# Altium schematic sheet yard-ice-cpu.SchDoc: Yard-Ice-CPU
size 365 x 274 mm; Revision: 1.0; SheetNumber: 3; SheetTotal: 5
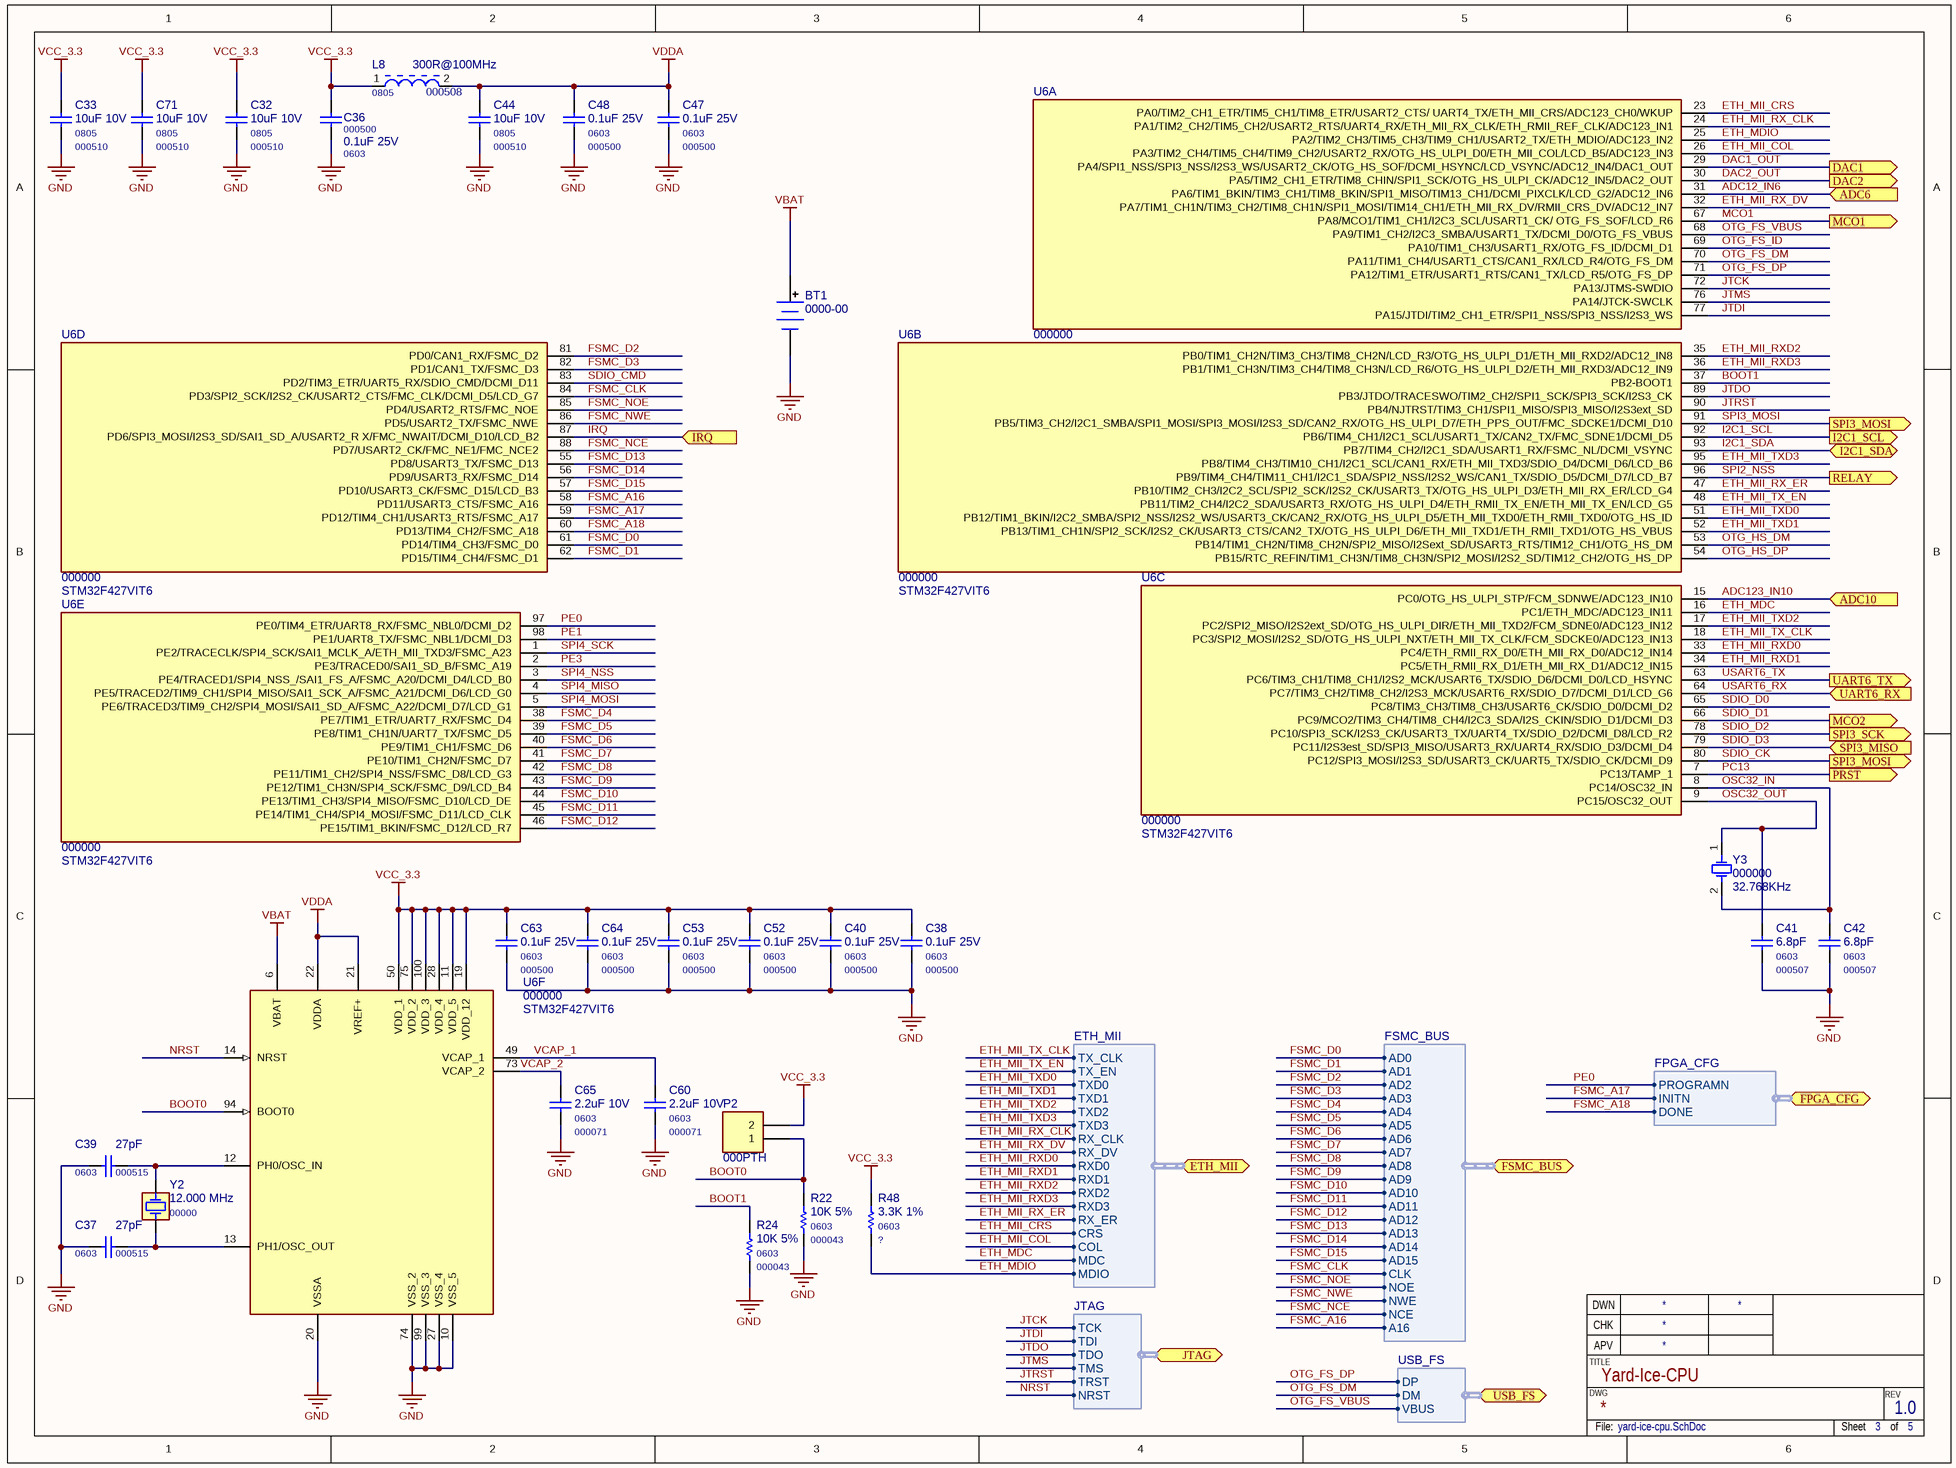
[diagram p0: yard-ice-cpu.SchDoc]

## Parts
BT1  0000-00  [CR-1632/VCN]
C32  000510  value 10uF 10V  Package: 0805  [C0805M]
C33  000510  value 10uF 10V  Package: 0805  [C0805M]
C36  000500  value 0.1uF 25V  Package: 0603  [C0603M]
C37  000515  value 27pF  Package: 0603  [C0603M]
C38  000500  value 0.1uF 25V  Package: 0603  [C0603M]
C39  000515  value 27pF  Package: 0603  [C0603M]
C40  000500  value 0.1uF 25V  Package: 0603  [C0603M]
C41  000507  value 6.8pF  Package: 0603  [C0603M]
C42  000507  value 6.8pF  Package: 0603  [C0603M]
C44  000510  value 10uF 10V  Package: 0805  [C0805M]
C47  000500  value 0.1uF 25V  Package: 0603  [C0603M]
C48  000500  value 0.1uF 25V  Package: 0603  [C0603M]
C52  000500  value 0.1uF 25V  Package: 0603  [C0603M]
C53  000500  value 0.1uF 25V  Package: 0603  [C0603M]
C60  000071  value 2.2uF 10V  Package: 0603  [C0603M]
C63  000500  value 0.1uF 25V  Package: 0603  [C0603M]
C64  000500  value 0.1uF 25V  Package: 0603  [C0603M]
C65  000071  value 2.2uF 10V  Package: 0603  [C0603M]
C71  000510  value 10uF 10V  Package: 0805  [C0805M]
L8  000508  value 300R@100MHz  Package: 0805  [L0805M]
P2  000PTH  [TSW-102-07-G-S]
R22  000043  value 10K 5%  Package: 0603  [R0603M]
R24  000043  value 10K 5%  Package: 0603  [R0603M]
R48  ?  value 3.3K 1%  Package: 0603  [R0603M]
U6  000000  value STM32F427VIT6  [LQFP100]  (parts A,B,C,D,E,F of 6)
Y2  00000  value 12.000 MHz  [ABM3-H]
Y3  000000  value 32.768KHz  [CA-301-V]

## Ports
ADC6 (in), ADC10 (in), DAC1 (out), DAC2 (out), ETH_MII (harness ETH_MII), FPGA_CFG (harness FPGA_CFG), FSMC_BUS (harness FSMC_BUS), I2C1_SCL (out), I2C1_SDA (bidir), IRQ (in), JTAG (harness JTAG), MCO1 (out), MCO2 (out), PRST (out), RELAY (out), SPI3_MISO (in), SPI3_MOSI (out), SPI3_SCK (out), UART6_RX (in), UART6_TX (out), USB_FS (harness USB_FS)

## Harnesses
ETH_MII: TX_CLK, TX_EN, TXD0, TXD1, TXD2, TXD3, RX_CLK, RX_DV, RXD0, RXD1, RXD2, RXD3, RX_ER, CRS, COL, MDC, MDIO
FSMC_BUS: AD0, AD1, AD2, AD3, AD4, AD5, AD6, AD7, AD8, AD9, AD10, AD11, AD12, AD13, AD14, AD15, CLK, NOE, NWE, NCE, A16
USB_FS: VBUS, DM, DP
JTAG: TDO, TDI, TCK, TMS, TRST, NRST
FPGA_CFG: DONE, INITN, PROGRAMN

## Nets
GND: BT1.2(-) C32.2 C33.2 C36.2 C37.1 C38.2 C39.1 C40.2 C41.1 C42.1 C44.2 C47.2 C48.2 C52.2 C53.2 C60.2 C63.2 C64.2 C65.2 C71.2 R22.1 R24.1 U6.10(VSS_5) U6.20(VSSA) U6.27(VSS_4) U6.74(VSS_2) U6.99(VSS_3)
VBAT: BT1.1(+) U6.6(VBAT)
VCC_3.3: C32.1 C33.1 C36.1 C38.1 C40.1 C52.1 C53.1 C63.1 C64.1 C71.1 L8.1 P2.2 R48.2 U6.11(VDD_5) U6.19(VDD_12) U6.28(VDD_4) U6.50(VDD_1) U6.75(VDD_2) U6.100(VDD_3)
VDDA: C44.1 C47.1 C48.1 L8.2 U6.21(VREF+) U6.22(VDDA)
ADC12_IN6: U6.31(PA6/TIM1_BKIN/TIM3_CH1/TIM8_BKIN/SPI1_MISO/TIM13_CH1/DCMI_PIXCLK/LCD_G2/ADC12_IN6) ; port ADC6
ADC123_IN10: U6.15(PC0/OTG_HS_ULPI_STP/FCM_SDNWE/ADC123_IN10) ; port ADC10
BOOT0: P2.1 R22.2 U6.94(BOOT0)
BOOT1: R24.2 U6.37(PB2-BOOT1)
DAC1_OUT: U6.29(PA4/SPI1_NSS/SPI3_NSS/I2S3_WS/USART2_CK/OTG_HS_SOF/DCMI_HSYNC/LCD_VSYNC/ADC12_IN4/DAC1_OUT) ; port DAC1
DAC2_OUT: U6.30(PA5/TIM2_CH1_ETR/TIM8_CHIN/SPI1_SCK/OTG_HS_ULPI_CK/ADC12_IN5/DAC2_OUT) ; port DAC2
ETH_MDC: U6.16(PC1/ETH_MDC/ADC123_IN11) ; port ETH_MII.MDC
ETH_MDIO: R48.1 U6.25(PA2/TIM2_CH3/TIM5_CH3/TIM9_CH1/USART2_TX/ETH_MDIO/ADC123_IN2) ; port ETH_MII.MDIO
ETH_MII_COL: U6.26(PA3/TIM2_CH4/TIM5_CH4/TIM9_CH2/USART2_RX/OTG_HS_ULPI_D0/ETH_MII_COL/LCD_B5/ADC123_IN3) ; port ETH_MII.COL
ETH_MII_CRS: U6.23(PA0/TIM2_CH1_ETR/TIM5_CH1/TIM8_ETR/USART2_CTS/_UART4_TX/ETH_MII_CRS/ADC123_CH0/WKUP) ; port ETH_MII.CRS
ETH_MII_RX_CLK: U6.24(PA1/TIM2_CH2/TIM5_CH2/USART2_RTS/UART4_RX/ETH_MII_RX_CLK/ETH_RMII_REF_CLK/ADC123_IN1) ; port ETH_MII.RX_CLK
ETH_MII_RX_DV: U6.32(PA7/TIM1_CH1N/TIM3_CH2/TIM8_CH1N/SPI1_MOSI/TIM14_CH1/ETH_MII_RX_DV/RMII_CRS_DV/ADC12_IN7) ; port ETH_MII.RX_DV
ETH_MII_RX_ER: U6.47(PB10/TIM2_CH3/I2C2_SCL/SPI2_SCK/I2S2_CK/USART3_TX/OTG_HS_ULPI_D3/ETH_MII_RX_ER/LCD_G4) ; port ETH_MII.RX_ER
ETH_MII_RXD0: U6.33(PC4/ETH_RMII_RX_D0/ETH_MII_RX_D0/ADC12_IN14) ; port ETH_MII.RXD0
ETH_MII_RXD1: U6.34(PC5/ETH_RMII_RX_D1/ETH_MII_RX_D1/ADC12_IN15) ; port ETH_MII.RXD1
ETH_MII_RXD2: U6.35(PB0/TIM1_CH2N/TIM3_CH3/TIM8_CH2N/LCD_R3/OTG_HS_ULPI_D1/ETH_MII_RXD2/ADC12_IN8) ; port ETH_MII.RXD2
ETH_MII_RXD3: U6.36(PB1/TIM1_CH3N/TIM3_CH4/TIM8_CH3N/LCD_R6/OTG_HS_ULPI_D2/ETH_MII_RXD3/ADC12_IN9) ; port ETH_MII.RXD3
ETH_MII_TX_CLK: U6.18(PC3/SPI2_MOSI/I2S2_SD/OTG_HS_ULPI_NXT/ETH_MII_TX_CLK/FCM_SDCKE0/ADC123_IN13) ; port ETH_MII.TX_CLK
ETH_MII_TX_EN: U6.48(PB11/TIM2_CH4/I2C2_SDA/USART3_RX/OTG_HS_ULPI_D4/ETH_RMII_TX_EN/ETH_MII_TX_EN/LCD_G5) ; port ETH_MII.TX_EN
ETH_MII_TXD0: U6.51(PB12/TIM1_BKIN/I2C2_SMBA/SPI2_NSS/I2S2_WS/USART3_CK/CAN2_RX/OTG_HS_ULPI_D5/ETH_MII_TXD0/ETH_RMII_TXD0/OTG_HS_ID) ; port ETH_MII.TXD0
ETH_MII_TXD1: U6.52(PB13/TIM1_CH1N/SPI2_SCK/I2S2_CK/USART3_CTS/CAN2_TX/OTG_HS_ULPI_D6/ETH_MII_TXD1/ETH_RMII_TXD1/OTG_HS_VBUS) ; port ETH_MII.TXD1
ETH_MII_TXD2: U6.17(PC2/SPI2_MISO/I2S2ext_SD/OTG_HS_ULPI_DIR/ETH_MII_TXD2/FCM_SDNE0/ADC123_IN12) ; port ETH_MII.TXD2
ETH_MII_TXD3: U6.95(PB8/TIM4_CH3/TIM10_CH1/I2C1_SCL/CAN1_RX/ETH_MII_TXD3/SDIO_D4/DCMI_D6/LCD_B6) ; port ETH_MII.TXD3
FSMC_A16: U6.58(PD11/USART3_CTS/FSMC_A16) ; port FSMC_BUS.A16
FSMC_A17: U6.59(PD12/TIM4_CH1/USART3_RTS/FSMC_A17) ; port FPGA_CFG.INITN
FSMC_A18: U6.60(PD13/TIM4_CH2/FSMC_A18) ; port FPGA_CFG.DONE
FSMC_CLK: U6.84(PD3/SPI2_SCK/I2S2_CK/USART2_CTS/FMC_CLK/DCMI_D5/LCD_G7) ; port FSMC_BUS.CLK
FSMC_D0: U6.61(PD14/TIM4_CH3/FSMC_D0) ; port FSMC_BUS.AD0
FSMC_D1: U6.62(PD15/TIM4_CH4/FSMC_D1) ; port FSMC_BUS.AD1
FSMC_D2: U6.81(PD0/CAN1_RX/FSMC_D2) ; port FSMC_BUS.AD2
FSMC_D3: U6.82(PD1/CAN1_TX/FSMC_D3) ; port FSMC_BUS.AD3
FSMC_D4: U6.38(PE7/TIM1_ETR/UART7_RX/FSMC_D4) ; port FSMC_BUS.AD4
FSMC_D5: U6.39(PE8/TIM1_CH1N/UART7_TX/FSMC_D5) ; port FSMC_BUS.AD5
FSMC_D6: U6.40(PE9/TIM1_CH1/FSMC_D6) ; port FSMC_BUS.AD6
FSMC_D7: U6.41(PE10/TIM1_CH2N/FSMC_D7) ; port FSMC_BUS.AD7
FSMC_D8: U6.42(PE11/TIM1_CH2/SPI4_NSS/FSMC_D8/LCD_G3) ; port FSMC_BUS.AD8
FSMC_D9: U6.43(PE12/TIM1_CH3N/SPI4_SCK/FSMC_D9/LCD_B4) ; port FSMC_BUS.AD9
FSMC_D10: U6.44(PE13/TIM1_CH3/SPI4_MISO/FSMC_D10/LCD_DE) ; port FSMC_BUS.AD10
FSMC_D11: U6.45(PE14/TIM1_CH4/SPI4_MOSI/FSMC_D11/LCD_CLK) ; port FSMC_BUS.AD11
FSMC_D12: U6.46(PE15/TIM1_BKIN/FSMC_D12/LCD_R7) ; port FSMC_BUS.AD12
FSMC_D13: U6.55(PD8/USART3_TX/FSMC_D13) ; port FSMC_BUS.AD13
FSMC_D14: U6.56(PD9/USART3_RX/FSMC_D14) ; port FSMC_BUS.AD14
FSMC_D15: U6.57(PD10/USART3_CK/FSMC_D15/LCD_B3) ; port FSMC_BUS.AD15
FSMC_NCE: U6.88(PD7/USART2_CK/FMC_NE1/FMC_NCE2) ; port FSMC_BUS.NCE
FSMC_NOE: U6.85(PD4/USART2_RTS/FMC_NOE) ; port FSMC_BUS.NOE
FSMC_NWE: U6.86(PD5/USART2_TX/FSMC_NWE) ; port FSMC_BUS.NWE
I2C1_SCL: U6.92(PB6/TIM4_CH1/I2C1_SCL/USART1_TX/CAN2_TX/FMC_SDNE1/DCMI_D5) ; port I2C1_SCL
I2C1_SDA: U6.93(PB7/TIM4_CH2/I2C1_SDA/USART1_RX/FSMC_NL/DCMI_VSYNC) ; port I2C1_SDA
IRQ: U6.87(PD6/SPI3_MOSI/I2S3_SD/SAI1_SD_A/USART2_R_X/FMC_NWAIT/DCMI_D10/LCD_B2) ; port IRQ
JTCK: U6.72(PA13/JTMS-SWDIO) ; port JTAG.TCK
JTDI: U6.77(PA15/JTDI/TIM2_CH1_ETR/SPI1_NSS/SPI3_NSS/I2S3_WS) ; port JTAG.TDI
JTDO: U6.89(PB3/JTDO/TRACESWO/TIM2_CH2/SPI1_SCK/SPI3_SCK/I2S3_CK) ; port JTAG.TDO
JTMS: U6.76(PA14/JTCK-SWCLK) ; port JTAG.TMS
JTRST: U6.90(PB4/NJTRST/TIM3_CH1/SPI1_MISO/SPI3_MISO/I2S3ext_SD) ; port JTAG.TRST
MCO1: U6.67(PA8/MCO1/TIM1_CH1/I2C3_SCL/USART1_CK/_OTG_FS_SOF/LCD_R6) ; port MCO1
NRST: U6.14(NRST) ; port JTAG.NRST
OSC32_IN: C42.2 U6.8(PC14/OSC32_IN) Y3.2
OSC32_OUT: C41.2 U6.9(PC15/OSC32_OUT) Y3.1
OTG_FS_DM: U6.70(PA11/TIM1_CH4/USART1_CTS/CAN1_RX/LCD_R4/OTG_FS_DM) ; port USB_FS.DM
OTG_FS_DP: U6.71(PA12/TIM1_ETR/USART1_RTS/CAN1_TX/LCD_R5/OTG_FS_DP) ; port USB_FS.DP
OTG_FS_ID: U6.69(PA10/TIM1_CH3/USART1_RX/OTG_FS_ID/DCMI_D1)
OTG_FS_VBUS: U6.68(PA9/TIM1_CH2/I2C3_SMBA/USART1_TX/DCMI_D0/OTG_FS_VBUS) ; port USB_FS.VBUS
OTG_HS_DM: U6.53(PB14/TIM1_CH2N/TIM8_CH2N/SPI2_MISO/I2Sext_SD/USART3_RTS/TIM12_CH1/OTG_HS_DM)
OTG_HS_DP: U6.54(PB15/RTC_REFIN/TIM1_CH3N/TIM8_CH3N/SPI2_MOSI/I2S2_SD/TIM12_CH2/OTG_HS_DP)
PC13: U6.7(PC13/TAMP_1) ; port PRST
PE0: U6.97(PE0/TIM4_ETR/UART8_RX/FSMC_NBL0/DCMI_D2) ; port FPGA_CFG.PROGRAMN
PE1: U6.98(PE1/UART8_TX/FSMC_NBL1/DCMI_D3)
PE3: U6.2(PE3/TRACED0/SAI1_SD_B/FSMC_A19)
SDIO_CK: U6.80(PC12/SPI3_MOSI/I2S3_SD/USART3_CK/UART5_TX/SDIO_CK/DCMI_D9) U6.91(PB5/TIM3_CH2/I2C1_SMBA/SPI1_MOSI/SPI3_MOSI/I2S3_SD/CAN2_RX/OTG_HS_ULPI_D7/ETH_PPS_OUT/FMC_SDCKE1/DCMI_D10) ; port SPI3_MOSI  [also labelled SPI3_MOSI]
SDIO_CMD: U6.83(PD2/TIM3_ETR/UART5_RX/SDIO_CMD/DCMI_D11)
SDIO_D0: U6.65(PC8/TIM3_CH3/TIM8_CH3/USART6_CK/SDIO_D0/DCMI_D2)
SDIO_D1: U6.66(PC9/MCO2/TIM3_CH4/TIM8_CH4/I2C3_SDA/I2S_CKIN/SDIO_D1/DCMI_D3) ; port MCO2
SDIO_D2: U6.78(PC10/SPI3_SCK/I2S3_CK/USART3_TX/UART4_TX/SDIO_D2/DCMI_D8/LCD_R2) ; port SPI3_SCK
SDIO_D3: U6.79(PC11/I2S3est_SD/SPI3_MISO/USART3_RX/UART4_RX/SDIO_D3/DCMI_D4) ; port SPI3_MISO
SPI2_NSS: U6.96(PB9/TIM4_CH4/TIM11_CH1/I2C1_SDA/SPI2_NSS/I2S2_WS/CAN1_TX/SDIO_D5/DCMI_D7/LCD_B7) ; port RELAY
SPI4_MISO: U6.4(PE5/TRACED2/TIM9_CH1/SPI4_MISO/SAI1_SCK_A/FSMC_A21/DCMI_D6/LCD_G0)
SPI4_MOSI: U6.5(PE6/TRACED3/TIM9_CH2/SPI4_MOSI/SAI1_SD_A/FSMC_A22/DCMI_D7/LCD_G1)
SPI4_NSS: U6.3(PE4/TRACED1/SPI4_NSS_/SAI1_FS_A/FSMC_A20/DCMI_D4/LCD_B0)
SPI4_SCK: U6.1(PE2/TRACECLK/SPI4_SCK/SAI1_MCLK_A/ETH_MII_TXD3/FSMC_A23)
USART6_RX: U6.64(PC7/TIM3_CH2/TIM8_CH2/I2S3_MCK/USART6_RX/SDIO_D7/DCMI_D1/LCD_G6) ; port UART6_RX
USART6_TX: U6.63(PC6/TIM3_CH1/TIM8_CH1/I2S2_MCK/USART6_TX/SDIO_D6/DCMI_D0/LCD_HSYNC) ; port UART6_TX
VCAP_1: C60.1 U6.49(VCAP_1)
VCAP_2: C65.1 U6.73(VCAP_2)
NetC37_2: C37.2 U6.13(PH1/OSC_OUT) Y2.2
NetC39_2: C39.2 U6.12(PH0/OSC_IN) Y2.1

## Notes on the sheet
- TITLE
- CHK
- DWN
- APV
- DWG
- REV
- File:
- Sheet
- of

## Library data of the parts
BT1 = CR-1632/VCN: PTH 16mm SMD Battery Vertical; MF: Panasonic; PN: 0000-00; ExtraInfo: *; Value: CR-1632/VCN; Package: *; Class: Battery; MF PN: CR-1632/VCN
C32 C33 C71 = C0805: SMD Ceramic Chip Capacitor - 0805 - X7R; MF PN: C2012X7R1A106K; PN: TDK; PN: 000510; MF: TDK
C36 C38 C40 C47 C48 C52 C53 C63 C64 = C0603: SMD Ceramic Chip Capacitor - 0603 - X7R; MF PN: C1608X7R1E104K; MF: TDK; PN: 000500
C37 C39 C41 C42 = C0603: SMD Ceramic Chip Capacitor - 0603
  C37 C39: PN: 000515
  C41 C42: PN: 000507
C44 = C0805: SMD Ceramic Chip Capacitor - 0805 - X7R; MF PN: C2012X7R1A106K; MF: TDK; PN: 000510
C60 C65 = C0603: SMD Ceramic Chip Capacitor - 0603 - X7R; MF: Taiyo Yuden; MF PN: LMK107B7225KA-T; PN: 000071
L8 = L0805: SMD Ferrite Bead 0805; MF PN: MMZ2012Y301B; MF: TDK; PN: 000508
P2 = Header 2: Header, 2-Pin; Value: 2x1; PN: 000PTH; Package: PTH
R22 R24 R48 = R0603: SMD Chip Resistor - 0603
  R22 R24: PN: 000043
  R48: PN: ?
U6 = STM32F427VIT6: ARM Cortex-M4,  2MB Flash, 256+4KB RAM; Package: LQFP100; PN: 000000; ExtraInfo: *
Y2 = ABM3: Miniature Ceramic SMD Crystal; MF: Abracon; MF PN: ABM3-12.000MHZ-B2-T; Package: ABM3; PN: 00000
Y3 = CA-301: Cylinder Crystal Unit; MF: Epson; PN: 000000; ExtraInfo: *